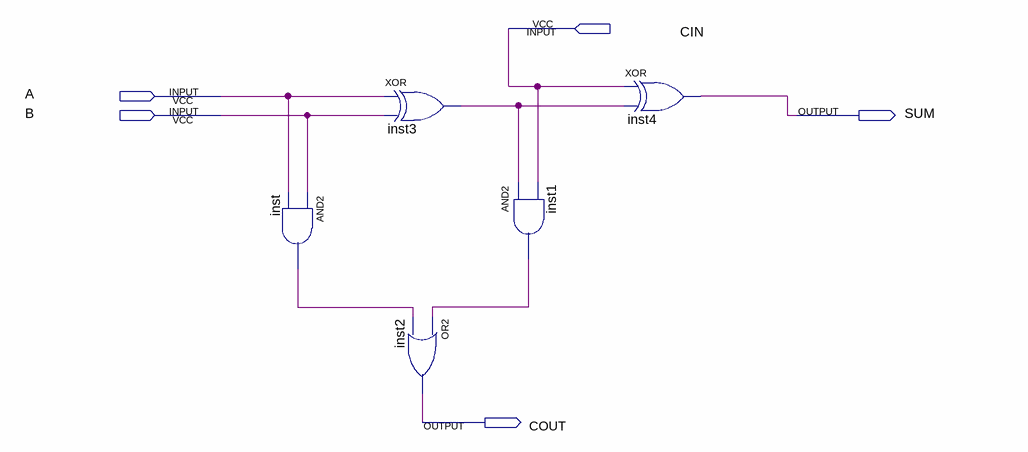
[diagram p0: schematic sheet]
// Quartus schematic FULL_ADDER_1bit.bdf as structural Verilog: 5 symbols, 5 pins
module FULL_ADDER_1bit (
  input  CIN,
  input  A,
  input  B,
  output SUM,
  output COUT
);

  wire inst1_out, inst3_out, inst_out;

  and inst (inst_out, B, A);
  xor inst3 (inst3_out, A, B);
  or inst2 (COUT, inst1_out, inst_out);
  and inst1 (inst1_out, inst3_out, CIN);
  xor inst4 (SUM, CIN, inst3_out);
endmodule
